# Altium project Pulser Driver 4,3(ProtoRev1).PrjPcb (part 1 of 2)
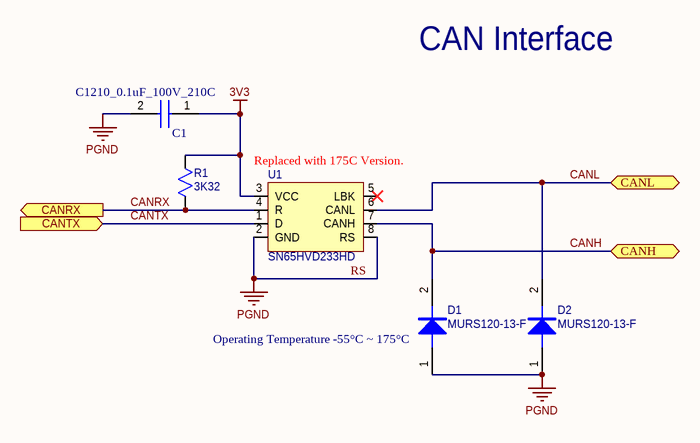
[diagram p0: Communications.SchDoc]
8 sheets, 224 parts. Net scope: flat (ports and power ports of the same name join across sheets).
Board file: Pulser Driver.PcbDoc
Sheets:
  Communications.SchDoc
  Control Interface.SchDoc
  230C_3V3_PSU_TPS40200.SchDoc
  Motor Driver.SchDoc
  230C_5V_PSU_TPS40200.SchDoc
  230C_12V_PSU_TPS40200.SchDoc
  Sensing.SchDoc
  Motor Interface.SchDoc

## Sheet Communications.SchDoc: Communications
size Tabloid; CompanyName: Vertex; Organization: Vertex Downhole Ltd.; Address1: 7004 5 St SE Unit C; Address2: Calgary, AB; Address3: T2H 2G3; Address4: Canada; DocumentNumber: 550014; Revision: 4.1; SheetNumber: 6; SheetTotal: 8; Operating Temperature Range: -55°C ~ 230°C

### Parts
C1  C1210_0.1uF_100V_210C  [C1210]
D1  MURS120-13-F  [SMB-D]
D2  MURS120-13-F  [SMB-D]
R1  3K32  [0603]
U1  SN65HVD233HD  [D8]

### Ports
CANH (bidir), CANL (bidir), CANRX (out), CANTX (in)

### Nets
3V3: C1.1 R1.2 U1.3(VCC)
RS: C1.2 D1.1(A) D2.1(A) U1.2(GND) U1.8(RS)  [also labelled PGND]
CANH: D1.2(K) U1.7(CANH) ; port CANH
CANL: D2.2(K) U1.6(CANL) ; port CANL
CANRX: R1.1 U1.4(R) ; port CANRX
CANTX: U1.1(D) ; port CANTX

Not connected (* = marked no-connect by the designer): U1 5(LBK)*

### Notes on the sheet
- CAN Interface
- (near U1) Replaced with 175C Version.
- (near D1) Operating Temperature -55°C ~ 175°C
- Title
- Size:
- Date:
- Tabloid
- Number:
- Time:
- Revision:
- Sheet
- of
- File:

### Library data of the parts
C1 = C1210H104J1GACTU: Capacitor; Manufacturer_Name: KEMET; Datasheet Link: https://content.kemet.com/datasheets/KEM_C1001_C0G_200C_SMD.pdf; Manufacturer_Part_Number: C1210H104J1GACTU; Mouser Part Number: 80-C1210H104J1GACTU; Mouser Price/Stock: https://www.mouser.co.uk/ProductDetail/KEMET/C1210H104J1GACTU?qs=w3%252Bcv6FlocpP4mccX4tnSA%3D%3D; Operating Temperature Range: -55C to +200C
D1 D2 = DIODE_1: Diode; Manufacturer: Diodes Inc.; Vendor: Digi-Key; Vendor PN: MURS120-FDITR-ND; Vertex PN: 6600001-01; Manu PN: MURS120-13-F
R1 = RES_3K32_0603_1%_1/10W: 3.32K OHM 1% 1/8W 0603; Manufacturer: Vishay; Vendor PN: 541-MCT0603MC3321FP500TR-ND; Vendor: Digi-Key; Manu PN: MCT0603MC3321FP500; Vertex PN: TBD; Supplier 1: Digikey; Supplier Part Number 1: 541-MCT0603MC3321FP500TR-ND
U1 = SN65HVD233HD: CAN Transceiver, 3V3; Manufacturer: TI; Vendor: DigiKey; Vendor PN: 296-28288-5-ND; Vertex PN: TBD; MPN: SN65HVD233HD; Footprint: SOIC-8; Operating Temperature Range: '-55C to 175C

## Sheet Control Interface.SchDoc: Control Interface
size Tabloid; CompanyName: Vertex; Organization: Vertex Downhole Ltd.; Address1: 10911 50th Street SE; Address2: Calgary, AB; Address3: T2C 3E5; Address4: Canada; DocumentNumber: 550014; Revision: 4.1; SheetNumber: 2; SheetTotal: 8
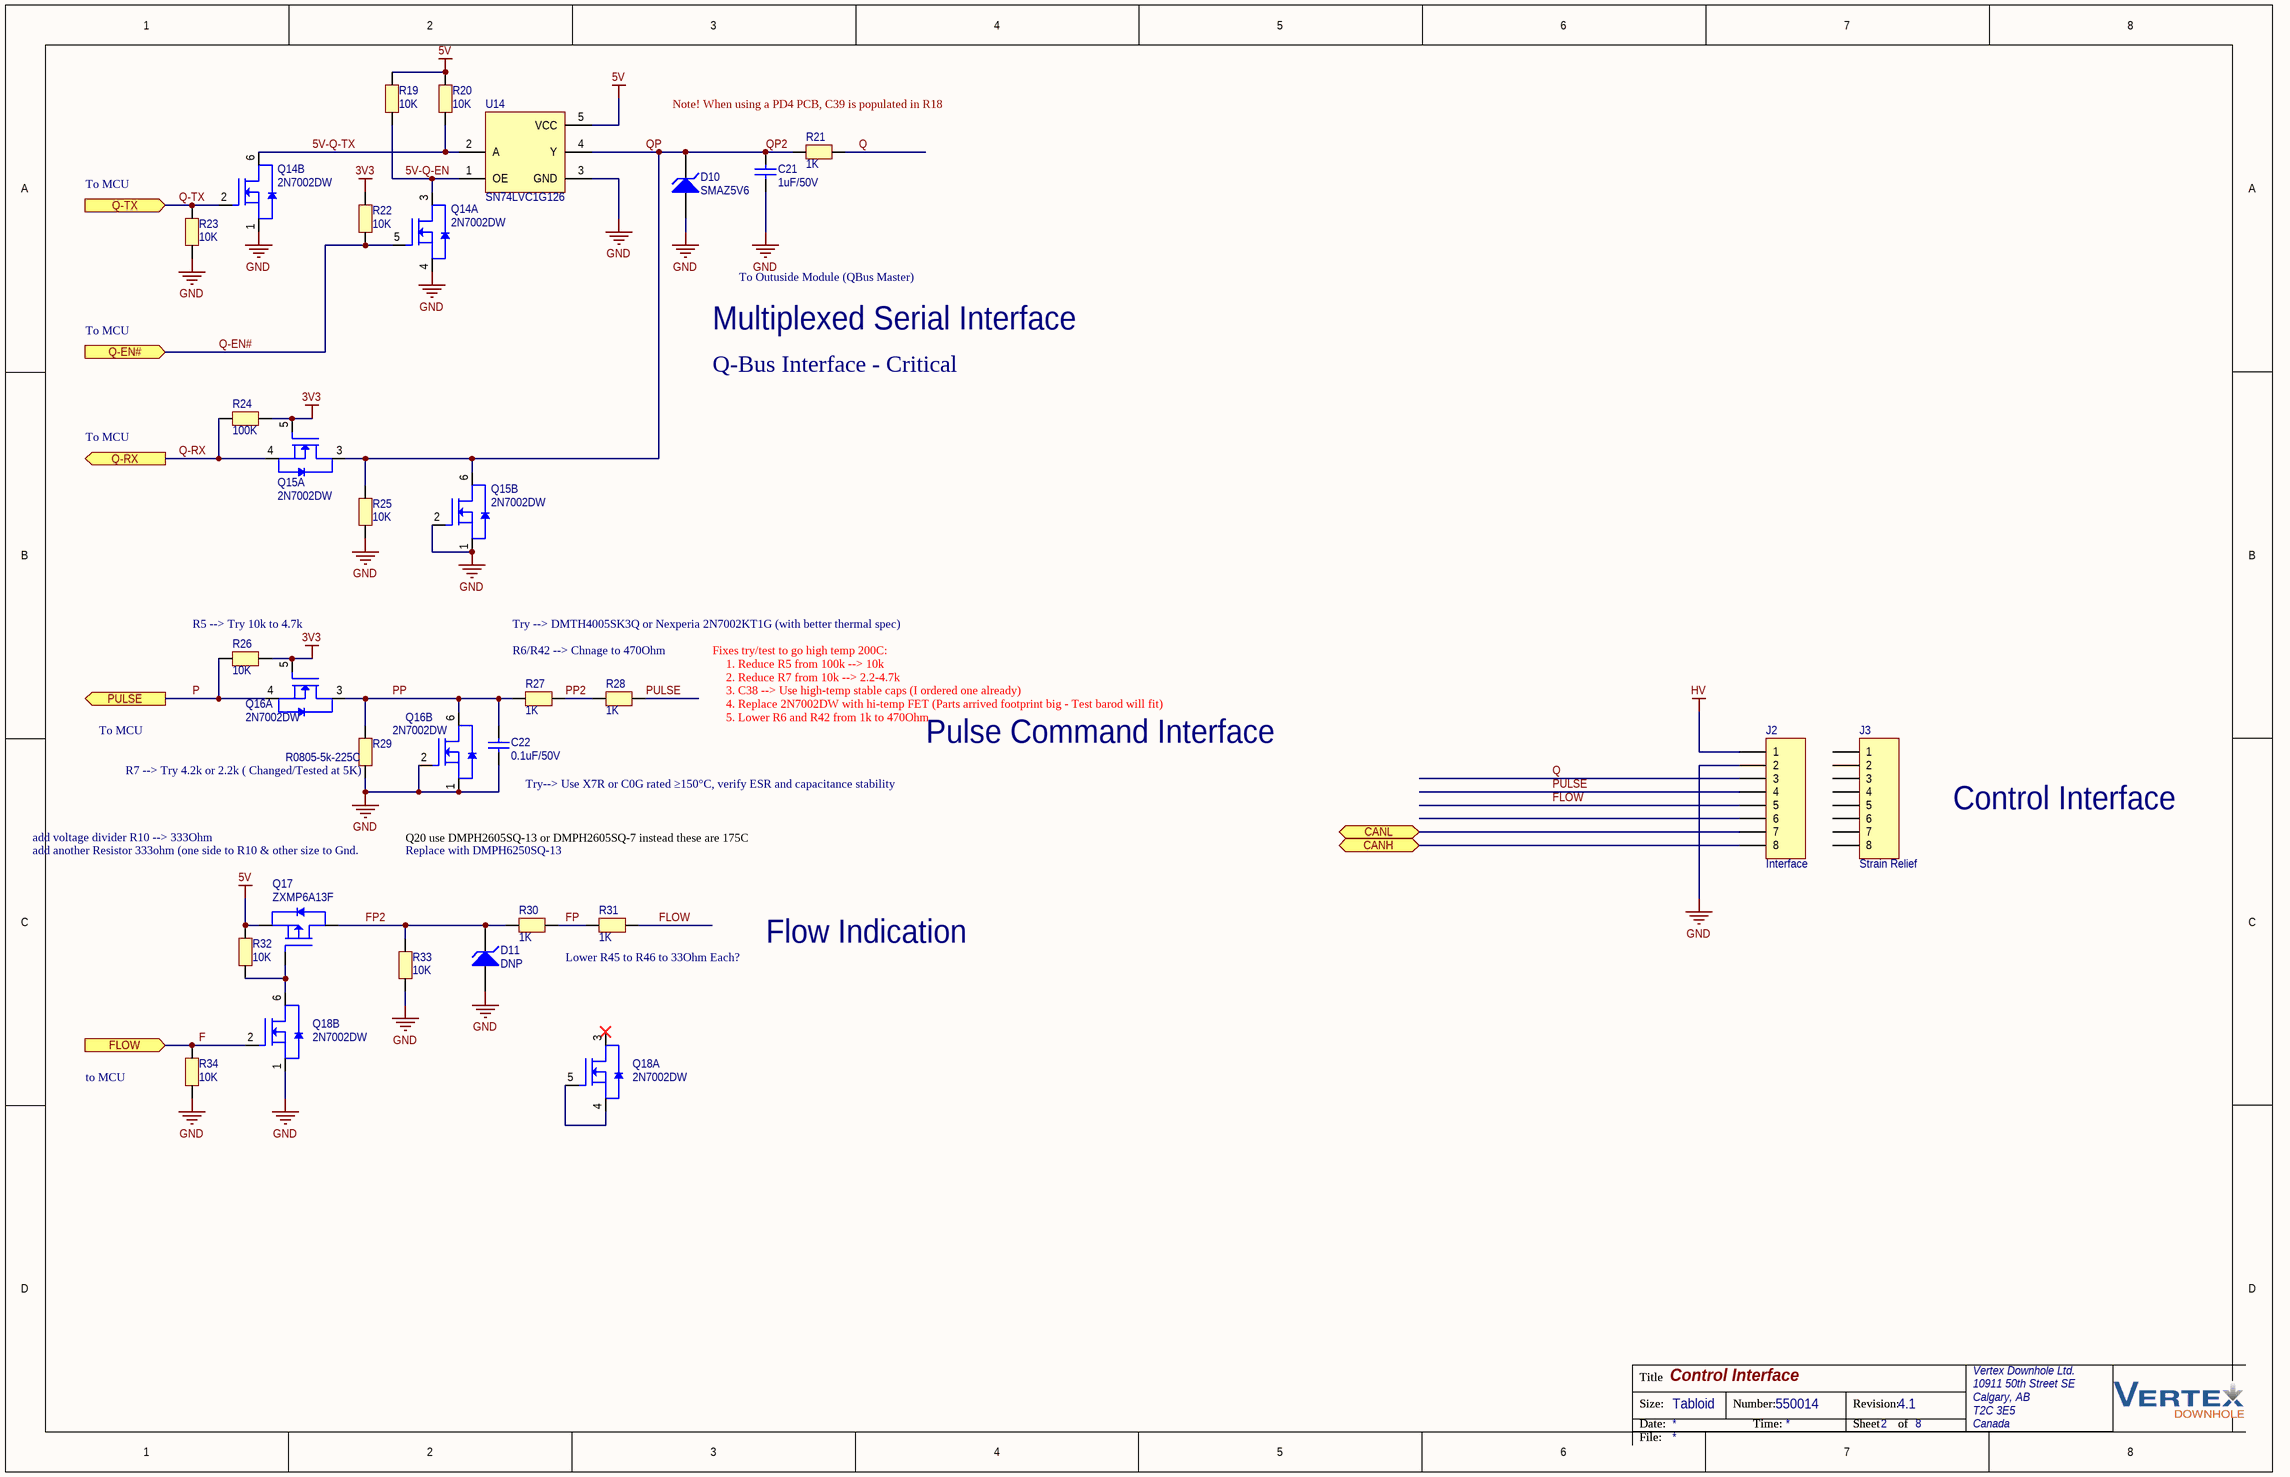
[diagram p1: Control Interface.SchDoc]

### Parts
C21  1uF/50V  [0805-CR]
C22  0.1uF/50V  [0805-CR]
D10  SMAZ5V6  [SMA]
D11  DNP  [SMA]
J2  Interface  [HDR1X8]
J3  Strain Relief  [HDR1X8]
Q14  2N7002DW  [DCK-6]  (parts A,B of 2)
Q15  2N7002DW  [DCK-6]  (parts A,B of 2)
Q16  2N7002DW  [DCK-6]  (parts A,B of 2)
Q17  ZXMP6A13F  [DGS]
Q18  2N7002DW  [DCK-6]  (parts A,B of 2)
R19  10K  [0805-CR]
R20  10K  [0805-CR]
R21  1K  [0805-CR]
R22  10K  [0805-CR]
R23  10K  [0805-CR]
R24  100K  [0805-CR]
R25  10K  [0805-CR]
R26  10K  [0805-CR]
R27  1K  [0805-CR]
R28  1K  [0805-CR]
R29  R0805-5k-225C  [0805]
R30  1K  [0805-CR]
R31  1K  [0805-CR]
R32  10K  [0805-CR]
R33  10K  [0805-CR]
R34  10K  [0805-CR]
U14  SN74LVC1G126  [DBV-5]

### Ports
CANH (bidir), CANL (bidir), FLOW (in), PULSE (out), Q-EN# (in), Q-RX (out), Q-TX (in)

### Nets
3V3: Q15.5(G1) Q16.5(G1) R22.1 R24.2 R26.1
5V: Q17.2(S) R19.1 R20.1 R32.1 U14.5(VCC)
GND: C21.1 C22.2 D10.1(A) D11.1(A) J2.2 Q14.1(S2) Q14.4(S1) Q15.1(S2) Q15.2(G2) Q16.1(S2) Q16.2(G2) Q18.1(S2) R23.2 R25.2 R29.2 R33.2 R34.2 U14.3(GND)
HV: J2.1  [project net 3V3_VDD]
5V-Q-EN: Q14.3(D1) R19.2 U14.1(OE)
5V-Q-TX: Q14.6(D2) R20.2 U14.2(A)
CANH: J2.8 ; port CANH
CANL: J2.7 ; port CANL
F: Q18.2(G2) R34.1 ; port FLOW
FLOW: J2.5 R31.2
FP: R30.2 R31.1
FP2: D11.2(K) Q17.3(D) R30.1 R33.1
P: Q16.4(S1) R26.2 ; port PULSE
PP: C22.1 Q16.3(D1) Q16.6(D2) R27.1 R29.1
PP2: R27.2 R28.1
PULSE: J2.4 R28.2
Q: J2.3 R21.2
Q-EN#: Q14.5(G1) R22.2 ; port Q-EN#
Q-RX: Q15.4(S1) R24.1 ; port Q-RX
Q-TX: Q14.2(G2) R23.1 ; port Q-TX
QP: C21.2 D10.2(K) Q15.3(D1) Q15.6(D2) R21.1 R25.1 U14.4(Y)  [also labelled QP2]
NetQ17_1: Q17.1(G) Q18.6(D2) R32.2
NetQ18_4: Q18.4(S1) Q18.5(G1)

Not connected (* = marked no-connect by the designer): J2 6; J3 1 2 3 4 5 6 7 8; Q18 3(D1)*

### Notes on the sheet
- Note! When using a PD4 PCB, C39 is populated in R18
- To MCU
- To Outuside Module (QBus Master)
- Multiplexed Serial Interface
- Q-Bus Interface - Critical
- R5 --> Try 10k to 4.7k
- Try --> DMTH4005SK3Q or Nexperia 2N7002KT1G (with better thermal spec)
- R6/R42 --> Chnage to 470Ohm
- Fixes try/test to go high temp 200C:
- 1. Reduce R5 from 100k --> 10k
- 2. Reduce R7 from 10k --> 2.2-4.7k
- 3. C38 --> Use high-temp stable caps (I ordered one already)
- 4. Replace 2N7002DW with hi-temp FET (Parts arrived footprint big - Test barod will fit)
- 5. Lower R6 and R42 from 1k to 470Ohm
- Pulse Command Interface
- (near R29) R7 --> Try 4.2k or 2.2k ( Changed/Tested at 5K)
- (near C22) Try--> Use X7R or C0G rated ≥150°C, verify ESR and capacitance stability
- Control Interface
- add voltage divider R10 --> 333Ohm
- add another Resistor 333ohm (one side to R10 & other size to Gnd.
- Replace with DMPH6250SQ-13
- Q20 use DMPH2605SQ-13 or DMPH2605SQ-7 instead these are 175C
- Lower R45 to R46 to 33Ohm Each?
- Flow Indication
- to MCU
- Title
- Size:
- Date:
- Tabloid
- Number:
- Time:
- Revision:
- Sheet
- of
- File:

### Library data of the parts
C21 = Cap: Capacitor; Manufacturer: TDK; Vendor: Digi-Key; Vendor PN: 445-CGA4J1X8L1H105K125ACCT-ND; Manu PN: CGA4J1X8L1H105K125AC; Vertex PN: TBD
C22 = Cap: Capacitor; Manufacturer: Murata Electronics North America; Vendor: Digi-Key; Vendor PN: 490-1666-1-ND; Manu PN: GRM21BR71H104KA01L; Vertex PN: 6280000
D10 D11 = D Zener: SMAZ5V6 5.6V Zener Diode; Manufacturer: Diodes Inc; Vendor: Digi-Key; Vendor PN: SMAZ5V6-FDICT-ND; Manu PN: SMAZ5V6-13-F; Vertex PN: 6600005
J2 J3 = Header 8: Header, 8-Pin
Q14-Q16 Q18 = 2N7002DW: 2N7002DW Dual N-Channel FET SC-70-6; Manufacturer: Fairchild Semiconductor; Vendor PN: 2N7002DWCT-ND; Vendor: Digi-Key; Vertex PN: 6500000; Manu PN: 2N7002DW
Q17 = Si2323DS: ZXMP6A13F 60V P-channel FET; Manufacturer: Diodes/Zetex; Manu PN: ZXMP6A13FTA; Vendor: Digi-Key; Vendor PN: ZXMP6A13FCT-ND; Vertex PN: 6500003
R19 R20 R22 R23 R25 R26 R32-R34 = RES: Resistor; Manufacturer: Yageo; Vendor PN: 311-10.0KCRCT-ND; Vendor: Digi-Key; Manu PN: RC0805FR-0710KL; Vertex PN: 6181002
R21 R27 R28 R30 R31 = RES: Resistor; Manufacturer: Yageo; Vendor PN: 311-1.00KCRCT-ND; Vendor: Digi-Key; Manu PN: RC0805FR-071KL; Vertex PN: 6180102
R24 = RES: Resistor; Manufacturer: Yageo; Vendor PN: 311-100KCRCT-ND; Vendor: Digi-Key; Manu PN: RC0805FR-07100KL; Vertex PN: 6181003
R29 = RES: Resistor; Manufacturer: VPG Foil Resistors; Vendor PN: Y4062-5.0KACT-ND; Vendor: Digi-Key; Manu PN: Y40625K00000Q0R
U14 = SN74LVC1G126: SN74LVC1G126DBV Tri-state Buffer (Non-Inverting OE); Manufacturer: Texas Instruments; Vendor: Digi-Key; Vendor PN: 296-11605-1-ND; Manu PN: SN74LVC1G126DBVR; Vertex PN: 6400024

## Sheet 230C_3V3_PSU_TPS40200.SchDoc: Communications
size Tabloid; CompanyName: Vertex; Organization: Vertex Downhole Ltd.; Address1: 7004 5 St SE Unit C; Address2: Calgary, AB; Address3: T2H 2G3; Address4: Canada; DocumentNumber: 550014; Revision: 4.1; SheetNumber: 6; SheetTotal: 8; Operating Temperature Range: -55°C ~ 230°C
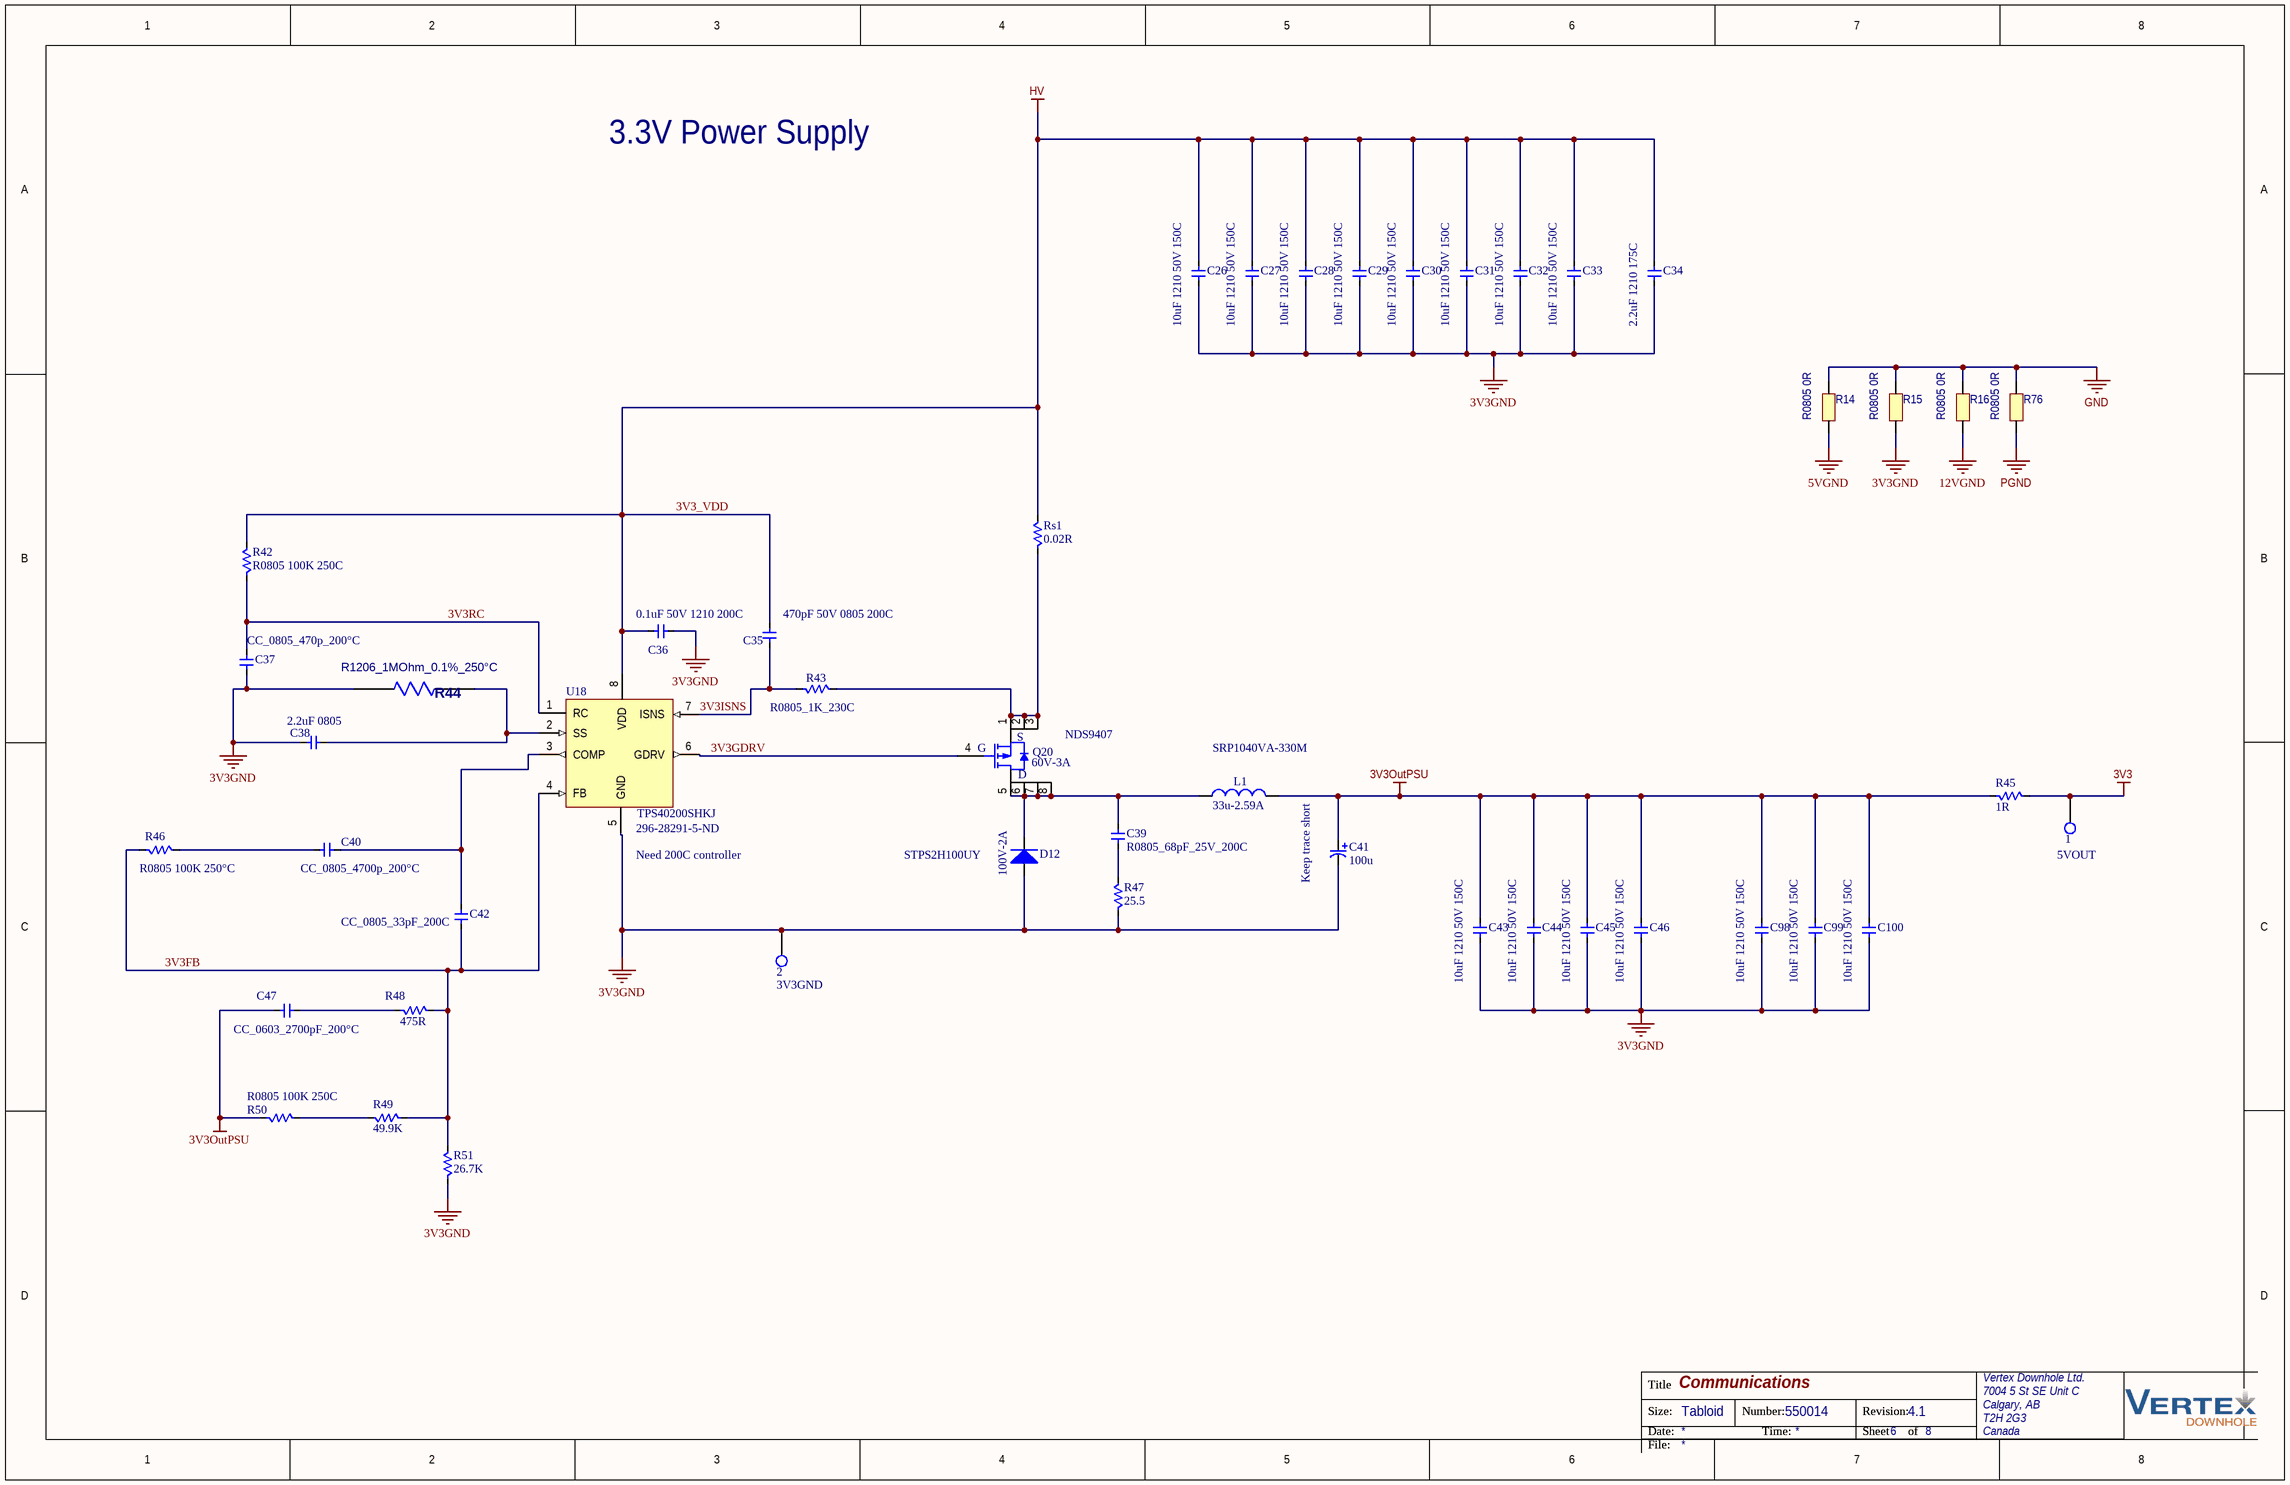
[diagram p2: 230C_3V3_PSU_TPS40200.SchDoc]

### Parts
1  5VOUT  [TP-S]  (no BOM)
2  3V3GND  [TP-S]  (no BOM)
C26  value 10uF 1210 50V 150C  [1210]  (hidden comment: GCM32EL8EH106KA07K)
C27  value 10uF 1210 50V 150C  [1210]  (hidden comment: GCM32EL8EH106KA07K)
C28  value 10uF 1210 50V 150C  [1210]  (hidden comment: GCM32EL8EH106KA07K)
C29  value 10uF 1210 50V 150C  [1210]  (hidden comment: GCM32EL8EH106KA07K)
C30  value 10uF 1210 50V 150C  [1210]  (hidden comment: GCM32EL8EH106KA07K)
C31  value 10uF 1210 50V 150C  [1210]  (hidden comment: GCM32EL8EH106KA07K)
C32  value 10uF 1210 50V 150C  [1210]  (hidden comment: GCM32EL8EH106KA07K)
C33  value 10uF 1210 50V 150C  [1210]  (hidden comment: GCM32EL8EH106KA07K)
C34  value 2.2uF 1210 175C  [1210]  (hidden comment: C1206H104J3GACTU)
C35  value 470pF 50V 0805 200C  [1210]  (hidden comment: C1206H104J3GACTU)
C36  value 0.1uF 50V 1210 200C  [0805]  (hidden comment: 0805D121J251KHT)
C37  value CC_0805_470p_200°C  [0805]  (hidden comment: C0805H471J1GACTU)
C38  value 2.2uF 0805  [0805]  (hidden comment: C0805C272K5HACTU)
C39  value R0805_68pF_25V_200C  [0805]  (hidden comment: C0805H680J3GACTU)
C40  value CC_0805_4700p_200°C  [0805]  (hidden comment: C0805H472J1GACT500)
C41  value 100u  [0805]  (hidden comment: 0805D121J251KHT)
C42  value CC_0805_33pF_200C  [1210]  (hidden comment: C1206H104J3GACTU)
C43  value 10uF 1210 50V 150C  [1210]  (hidden comment: GCM32EL8EH106KA07K)
C44  value 10uF 1210 50V 150C  [1210]  (hidden comment: GCM32EL8EH106KA07K)
C45  value 10uF 1210 50V 150C  [1210]  (hidden comment: GCM32EL8EH106KA07K)
C46  value 10uF 1210 50V 150C  [1210]  (hidden comment: GCM32EL8EH106KA07K)
C47  value CC_0603_2700pF_200°C  [0603]  (hidden comment: C1206H104J3GACTU)
C98  value 10uF 1210 50V 150C  [1210]  (hidden comment: GCM32EL8EH106KA07K)
C99  value 10uF 1210 50V 150C  [1210]  (hidden comment: GCM32EL8EH106KA07K)
C100  value 10uF 1210 50V 150C  [1210]  (hidden comment: GCM32EL8EH106KA07K)
D12  value 100V-2A  [SMB]  (hidden comment: STPS2H100UY)
L1  value 33u-2.59A  [IND_CB_DRA125]  (hidden comment: DRA125-470-R)
Q20  value 60V-3A  [SOIC_S9407_ONS]  (hidden comment: NDS9407)
R14  R0805 0R  [0805-CR]
R15  R0805 0R  [0805-CR]
R16  R0805 0R  [0805-CR]
R42  value R0805 100K 250C  [0805]  (hidden comment: PATT0805E1003BGT1)
R43  value R0805_1K_230C  [0805]  (hidden comment: ERJ-PB6B6812V)
R44  R1206_1MOhm_0.1%_250°C  [1206]
R45  value 1R  [0805]  (hidden comment: RS73F2ATTD1501B)
R46  value R0805 100K 250°C  [0805]  (hidden comment: PATT0805E1003BGT1)
R47  value 25.5  [0805]  (hidden comment: ERJ-PB6B1004V)
R48  value 475R  [0805]  (hidden comment: ERJ-PB6B6812V)
R49  value 49.9K  [0805]  (hidden comment: PATT0603E49R9BGT1)
R50  value R0805 100K 250C  [0805]  (hidden comment: PATT0805E1003BGT1)
R51  value 26.7K  [0805]  (hidden comment: RNCP0805FTD1R00)
R76  R0805 0R  [0805-CR]
Rs1  value 0.02R  [1206]  (hidden comment: ERJ-8CWFR020V)
U18  Supplier Part Number 1: 296-28291-5-ND  [SOIC_S9407_ONS]  (hidden comment: TPS40200SHKJ)

### Nets
3V3: 1.1 R45.2
3V3_VDD: C26.2 C27.2 C28.2 C29.2 C30.2 C31.2 C32.2 C33.2 C34.2 C35.1 C36.1 R42.2 Rs1.2 U18.8(VDD)  [also labelled HV]
3V3GND: 2.1 C26.1 C27.1 C28.1 C29.1 C30.1 C31.1 C32.1 C33.1 C34.1 C36.2 C37.1 C38.1 C41.2 C43.1 C44.1 C45.1 C46.1 C98.1 C99.1 C100.1 D12.A R15.1 R44.1(A) R47.1 R51.1 U18.5(GND)
3V3OutPSU: C41.1 C43.2 C44.2 C45.2 C46.2 C47.1 C98.2 C99.2 C100.2 L1.2 R45.1 R50.1
5VGND: R14.1
12VGND: R16.1
GND: R14.2 R15.2 R16.2 R76.2
PGND: R76.1  [project net RS]
3V3FB: C42.1 R46.1 R48.2 R49.1 R51.2 U18.4(FB)
3V3GDRV: Q20.4(G) U18.6(GDRV)
3V3ISNS: C35.2 R43.1 U18.7(ISNS)
3V3RC: C37.2 R42.1 U18.1(RC)
NetC38_2: C38.2 R44.2(B) U18.2(SS)
NetC39_1: C39.1 R47.2
NetC39_2: C39.2 D12.K L1.1 Q20.5(D) Q20.6(D) Q20.7(D) Q20.8(D)
NetC40_1: C40.1 R46.2
NetC40_2: C40.2 C42.2 U18.3(COMP)
NetC47_2: C47.2 R48.1
NetQ20_1: Q20.1(S) Q20.2(S) Q20.3(S) R43.2 Rs1.1
NetR49_2: R49.2 R50.2

### Notes on the sheet
- 3.3V Power Supply
- (near Q20) NDS9407
- (near L1) SRP1040VA-330M
- (near U18) Need 200C controller
- STPS2H100UY
- Keep trace short
- Title
- Size:
- Date:
- Tabloid
- Number:
- Time:
- Revision:
- Sheet
- of
- File:

### Library data of the parts
1 2 = TP: Test  Point; Number: PMT104887; Subtype: Test Loop; Num Connections: 1; RoHS: 0; Package: Through hole
C26 C43 = CC-1210: CAP CER 0.1UF 50V C0G/NP0 1210 200C; Tolerance: ±10%; Temp. Coeff.: X8L; Mfg: Murata Electronics; Vendor: Digi-Key; VendorPN: 490-GCM32EL8EH106KA07KCT-ND; Do not load: 0; Class: Epart; CES#: *; Voltage: 50V; Temperature: -55°C ~ 150°C; Height: 1.6mm; MfgPN: GCM32EL8EH106KA07K; Unit Price: 19.5; Notes: *; Package: CC-1210; Dimension: 3.20mm x 1.60mm; #1Mfg: *; #1MfgPN: *; Temperature Tested: *
C27-C33 C44-C46 C98-C100 = CC-1210: CAP CER 0.1UF 50V C0G/NP0 1210 200C; Tolerance: ±5%; Temp. Coeff.: X8L; Mfg: Murata Electronics; Vendor: Digi-Key; VendorPN: 490-GCM32EL8EH106KA07KCT-ND; Do not load: 0; Class: Epart; CES#: *; Voltage: 50V; Temperature: -55°C ~ 200°C; Height: 1.6mm; MfgPN: GCM32EL8EH106KA07K; Unit Price: 19.5; Notes: *; Package: CC-1210; Dimension: 3.20mm x 1.60mm; #1Mfg: *; #1MfgPN: *; Temperature Tested: *
C34 = CC-1210: CAP CER 0.1UF 50V C0G/NP0 1210 200C; Voltage: 25V; Tolerance: ±5%; Temp. Coeff.: C0G, NP0; Mfg: KEMET; Vendor: Digi-Key; VendorPN: 399-5750; Do not load: 0; Class: Epart; CES#: *; Temperature: -55°C ~ 200°C; Height: 1.6mm; MfgPN: C1206H104J3GACTU; Unit Price: 19.5; Notes: *; Package: CC-1206; Dimension: 3.20mm x 1.60mm; #1Mfg: *; #1MfgPN: *; Temperature Tested: *
C35 = CC-0805-100p-100V-10%-200C-NP0: CAP CER 470PF 50V C0G/NP0 0805 200C; Voltage: 100V; Tolerance: ±5%; Temp. Coeff.: C0G, NP0; Mfg: Vishay Vitramont; MfgPN: VJ0805D471JXAQJHT; Vendor: Digi-Key; VendorPN: 720-VJ0805D471JXAQJHTCT-ND; Do not load: 0; Class: Epart; Temperature: -55°C ~ 200°C; Height: 1.37mm; Unit Price: 0.34; Notes: *; Package: CC-0805; Dimension: 1.60mm x 0.80mm; #1Mfg: *; #1MfgPN: *; Temperature Tested: *
C36 = CC-1210: CAP CER 0.1UF 50V C0G/NP0 1210 200C; Voltage: 25V; Tolerance: ±5%; Temp. Coeff.: C0G, NP0; Mfg: KEMET; MfgPN: C1206H104J3GACTU; Vendor: Digi-Key; VendorPN: 399-5750; Do not load: 0; Class: Epart; CES#: *; Temperature: -55°C ~ 200°C; Height: 1.6mm; Unit Price: 19.5; Notes: *; Package: CC-1206; Dimension: 3.20mm x 1.60mm; #1Mfg: *; #1MfgPN: *; Temperature Tested: *
C37 = CC-0805-470p-100V-10%-150C-NP0: CAPACITOR CER 470PF 100V C0G/NP0 0805; Tolerance: ±10%; Temp. Coeff.: C0G, NP0; Mfg: KEMET; Vendor: Digi-Key; VendorPN: 720-1262; Do not load: 0; Class: Epart; CES#: *; Voltage: 100V; Temperature: -55°C ~ 200°C; Height: 1.25mm; MfgPN: C0805H471J1GACTU; Unit Price: 0.47; Notes: *; Package: CC-0805; Dimension: 2.00mm x 1.25mm; #1Mfg: *; #1MfgPN: *; Temperature Tested: *
C38 = CC-0805-47n-25V-5%-125C-NP0: CAPACITOR CER 0.047UF 25V C0G/NP0 0805; Tolerance: ±5%; Temp. Coeff.: C0G, NP0; Mfg: KEMET; MfgPN: C0805C473J3GACAUTO; Vendor: Digi-Key; VendorPN: 399-6970; Do not load: 0; Class: Epart; CES#: *; Voltage: 25V; Temperature: -55°C ~ 125°C; Height: 1.25mm; Unit Price: 0.95; Notes: *; Package: CC-0805; Dimension: 2.00mm x 1.25mm; #1Mfg: *; #1MfgPN: *; Temperature Tested: *
C39 = CC-0805-2200p-100V-5%-200C-NP0: CAPACITOR CER 2200PF 100V C0G/NP0 0805; Tolerance: ±5%; Temp. Coeff.: C0G, NP0; Mfg: KEMET; Vendor: Mouser; VendorPN: 80-C0805H680J3G; Do not load: 0; Class: Epart; Voltage: 100V; Temperature: -55°C ~ 200°C; Height: 0.9mm; MfgPN: C0805H680J3GACTU; Unit Price: 2.65; Notes: *; Package: CC-0805; Dimension: 2.00mm x 1.25mm; #1Mfg: *; #1MfgPN: *; Temperature Tested: *; Supplier 1: Digi-Key
C40 = CC-0805-2200p-100V-5%-200C-NP0: CAPACITOR CER 2200PF 100V C0G/NP0 0805; Tolerance: ±5%; Temp. Coeff.: C0G, NP0; Mfg: KEMET; Vendor: Digi-Key; VendorPN: 399-9996-2-ND; Do not load: 0; Class: Epart; Voltage: 100V; Temperature: -55°C ~ 200°C; Height: 0.9mm; MfgPN: C0805H472J1GACT500; Unit Price: 2.65; Notes: *; Package: CC-0805; Dimension: 2.00mm x 1.25mm; #1Mfg: *; #1MfgPN: *; Temperature Tested: *; Supplier 1: Digi-Key
C41 = CT-2917-100u-16V-10%-150C: CAPACITOR TANT 100UF 16V 10% 2917; Mfg: KEMET; MfgPN: T498X107K016ATE075; Vendor: Digi-Key; VendorPN: 399-5207; Do not load: 0; Class: Epart; CES#: *; Voltage: 16V; Tolerance: ±10%; Temperature: -55°C ~ 150°C; Height: 4.1mm; Unit Price: 6.63; Notes: *; Package: CT-2917; Dimension: 7.30mm x 4.30mm; #1Mfg: *; #1MfgPN: *; Temperature Tested: *
C42 = CC-0805-120p-100V-5%-200C-NP0: CAPACITOR CER 120PF 250V NP0 0805; Tolerance: ±5%; Temp. Coeff.: C0G, NP0; Mfg: Knowles Novacap; MfgPN: 0805D121J251KHT; Vendor: Digi-Key; Do not load: 0; Class: Epart; Voltage: 250V; Temperature: -55°C ~ 200°C; Height: 1.37mm; VendorPN: 0805D121J251KHT; Unit Price: 0.25; Notes: *; Package: CC-0805; Dimension: 2.03mm x 1.27mm; #1Mfg: *; #1MfgPN: *; Temperature Tested: *
C47 = CC-0805-2700p-50V-10%-150C: CAPACITOR CER 2700PF 50V X8R 0805; Tolerance: ±5%; Temp. Coeff.: C0G; Mfg: KEMET; MfgPN: C0603H272J5GACTU; Vendor: Digi-Key; VendorPN: 399-C0603H272J5GACTUCT-ND; Do not load: 0; Class: Epart; CES#: *; Voltage: 50V; Temperature: -55°C ~ 200°C; Height: 1.25mm; Unit Price: 0.84; Notes: *; Package: CC-0805; Dimension: 2.00mm x 1.25mm; #1Mfg: *; #1MfgPN: *; Temperature Tested: *
D12 = DS-SMB-100V-2A: DIODE SCHOTTKY 100V 2A SMB; Mfg: STMicroelectronics; Vendor: Digi-Key; VendorPN: 497-11093; Do not load: 0; Class: Epart; CES#: *; Temperature: -40°C ~ 175°C; Voltage: 100V; Height: 1.9 mm; MfgPN: STPS2H100UY; Unit Price: 0.81; Notes: *; Current: 2A; Package: SMB; Dimension: 3.5 X 2.8 X 1.9 mm; #1Mfg: *; #1MfgPN: *; Temperature Tested: *
L1 = LL-12.5X12.5-47u-2.59A: INDUCTOR 47UH 2.59A 81 MOHM; DC Resistance (DCR): 81 mOhm; Mfg: Eaton; Vendor: Digi-Key; VendorPN: 283-3577; Do not Load: 0; Tolerance: ±20%; Class: Epart; CES#: *; Temperature: -40°C ~ 165°C; Height: 6 mm; MfgPN: DRA125-470-R; Unit Price: 4.36; Current: 2.59A; Package: LL-12.5X12.5; Dimension: 12.50mm x 12.50mm; #2Mfg: *; #2MfgPN: *; Temperature Tested: *
Q20 = QF-SOIC8-PCH-60V-3A: MOSFET P-CH 60V 3A 8-SOIC; Mfg: ON Semiconductor; Vendor: Digi-Key; Do not Load: 0; Power: 2.5W (Ta); Rds On: 150 mOhm @ 3A, 10V; Class: Epart; Temperature: -55°C ~ 175°C (TJ); Voltage: 60V; Height: 1.7 mm; MfgPN: NDS9407; VendorPN: NDS9407; Unit price: 1.55; Package: SOIC8; Dimension: 6.2 X 5.0 X 1.7 mm; Current: 3A; #2Mfg: *; #2MfgPN: *; Temperature Tested: *
R14-R16 R76 = RES: as R19 on sheet Control Interface
R42 R46 R50 = RS-0805-9.1K-0.1%-1/4W-155C: 100 kOhms ±0.1% 0.2W, 1/5W Chip Resistor 0805 (2012 Metric); Temp. Coeff.: ±25ppm/°C; Mfg: Vishay Dale Thin Film; Vendor: Digi-Key; VendorPN: 764-1065-1-ND; Do not load: 0; Power: 0.25W; Class: Epart; Tolerance: ±0.1%; Temperature: -55°C ~ 250°C; Height: 0.46 mm; MfgPN: PATT0805E1003BGT1; Unit Price: 0.55; Notes: *; Package: RS-0805; Dimension: 1.60mm x 0.80mm; #2Mfg: *; #2MfgPN: *; Temperature Tested: *
R43 = RS-0805-1K-0.1%-1/8W-155C: RESISTOR SMD 1K OHM 0.1% 1/8W 0805; Tolerance: ±1%; Temp. Coeff.: ±25ppm/°C; Mfg: Vishay / Sfernice; MfgPN: CHPHT0805K1001FGT; Vendor: Mouser; VendorPN: 71-CHPHT0805K1001FGT; Do not load: 0; Power: 0.125W; Class: Epart; CES#: *; Temperature: -55°C ~ 230°C; Height: 0.7 mm; Notes: *; Package: RS-0805; Dimension: 2.00mm x 1.25mm; #2Mfg: *; #2MfgPN: *; Temperature Tested: *
R44 = RC_1206: 1206; Part Field 1: Description Resistor in 1206 package; MPN: PATT1206E1004BGT1; Mfr: Vishay Dale Thin Film
R45 = RS-0805-1R-1%-0.25W-155C: RESISTOR SMD 1 OHM 1% 1/4W 0805; Temp. Coeff.: ±100ppm/°C; Mfg: Stackpole Electronics Inc.; MfgPN: RNCP0805FTD1R00; Vendor: Digi-Key; Do not load: 0; Power: 0.25W; Class: Epart; CES#: *; Tolerance: ±1%; Temperature: -55°C ~ 155°C; Height: 0.7 mm; VendorPN: RNCP0805FTD1R00; Unit Price: 0.15; Notes: *; Package: RS-0805; Dimension: 2.00mm x 1.25mm; #2Mfg: *; #2MfgPN: *; Temperature Tested: *
R47 = RS-0805-10.2K-0.1%-0.25W-155C: RESISTOR SMD 10.2K OHM 1% 1/4W 0805; Temp. Coeff.: ±50ppm/°C; Mfg: Panasonic Electronic Components; MfgPN: ERJ-PB6B1022V; Vendor: Digi-Key; VendorPN: P20709TR-ND; Do not load: 0; Power: 0.25W; Class: Epart; Tolerance: ±1%; Temperature: -55°C ~ 155°C; Height: 0.7 mm; Unit Price: 0.55; Notes: *; Package: RS-0805; Dimension: 2.00mm x 1.25mm; #2Mfg: *; #2MfgPN: *; Temperature Tested: *
R48 = RS-0805-475R-0.1%-0.25W-155C: RESISTOR SMD 475 OHM 0.1% 1/10W 0805; Temp. Coeff.: ±50ppm/°C; Mfg: Panasonic Electronic Components; MfgPN: ERJ-PB6B4750V; Vendor: Digi-Key; VendorPN: P20557; Do not load: 0; Power: 0.25W; Class: Epart; Tolerance: ±0.1%; Temperature: -55°C ~ 155°C; Height: 0.7 mm; Unit Price: 0.55; Notes: *; Package: RS-0805; Dimension: 2.00mm x 1.25mm; #2Mfg: *; #2MfgPN: *; Temperature Tested: *
R49 = RS-0805-1.5K-0.1%-1/4W-155C: 49.9 Ohms ±0.1% 0.15W Chip Resistor 0603 (1608 Metric) Anti-Sulfur, Automotive AEC-Q200, Moisture Resistant Thin Film; Temp. Coeff.: ±25ppm/°C; Mfg: Vishay Dale Thin Film; Vendor: Digi-Key; VendorPN: 764-1019-1-ND; Do not load: 0; Power: 0.250W; Class: Epart; CES#: *; Tolerance: ±0.1%; Temperature: -55°C ~ 255°C; Height: 0.46 mm; MfgPN: PATT0603E49R9BGT1; Notes: *; Package: RS-0805; Dimension: 2.00mm x 1.25mm; #2Mfg: *; #2MfgPN: *; Temperature Tested: *
R51 = RS-0805-49.9R-0.25%-0.25W-155C: RESISTOR SMD 49.9 OHM 0.1% 1/25W 0805; Temp. Coeff.: ±25ppm/°C; Mfg: KOA Speer Electronics, Inc.; MfgPN: RS73G2ATTD49R9C; Vendor: Digi-Key; VendorPN: 2019-RS73G2ATTD49R9CTR-ND; Do not load: 0; Power: 0.25W; Class: Epart; Tolerance: ±0.1%; Temperature: -55°C ~ 155°C; Height: 0.5 mm; Unit Price: 0.113; Notes: *; Package: RS-0603; Dimension: 1.60mm x 0.80mm; #2Mfg: *; #2MfgPN: *; Temperature Tested: *
Rs1 = RS-1206-0.02R-1%-1W-155C: RESISTOR SMD 0.02 OHM 1% 1W 1206; Temp. Coeff.: ±75ppm/°C; Mfg: Panasonic Electronic Components; Vendor: Digi-Key; VendorPN: P0.02BV; Do not load: 0; Class: Epart; CES#: *; Tolerance: ±1%; Temperature: -55°C ~ 155°C; Height: 0.6; MfgPN: ERJ-8CWFR020V; Unit Price: 1.04; Notes: *; Power: 1W; Package: RS-1206; Dimension: 1.60mm x 3.20mm; #2Mfg: *; #2MfgPN: *; Temperature Tested: *
U18 = UP-SREG-CFP8-Buck-ADJ-TPS40200: IC REG CTRLR BUCK 8CFP; Mfg: Texas Instruments; Vendor: Digi-Key; VendorPN: 296-28291; Do not load: 0; Voltage Output: Adjustive; Voltage Input: 5.5 V ~ 52 V; Class: Epart; Topology: Buck; Temperature: -55°C ~ 210°C (TA); Height: 2.0 mm; MfgPN: TPS40200SHKJ; Unit Price: 140.54; Notes: *; Package: CFP-8; Dimension: 24.7 X 7.3 X 2.0; #2Mfg: *; #2MfgPN: *; Temperature Tested: *; Value: TPS40200SHKJ; Supplier 1: Digi-Key

## Sheet Motor Driver.SchDoc: Motor Driver
size Tabloid; CompanyName: Vertex; Organization: Vertex Downhole Ltd.; Address1: 10911 50th Street SE; Address2: Calgary, AB; Address3: T2C 3E5; Address4: Canada; DocumentNumber: 550014; Revision: 4.1; SheetNumber: 8; SheetTotal: 8
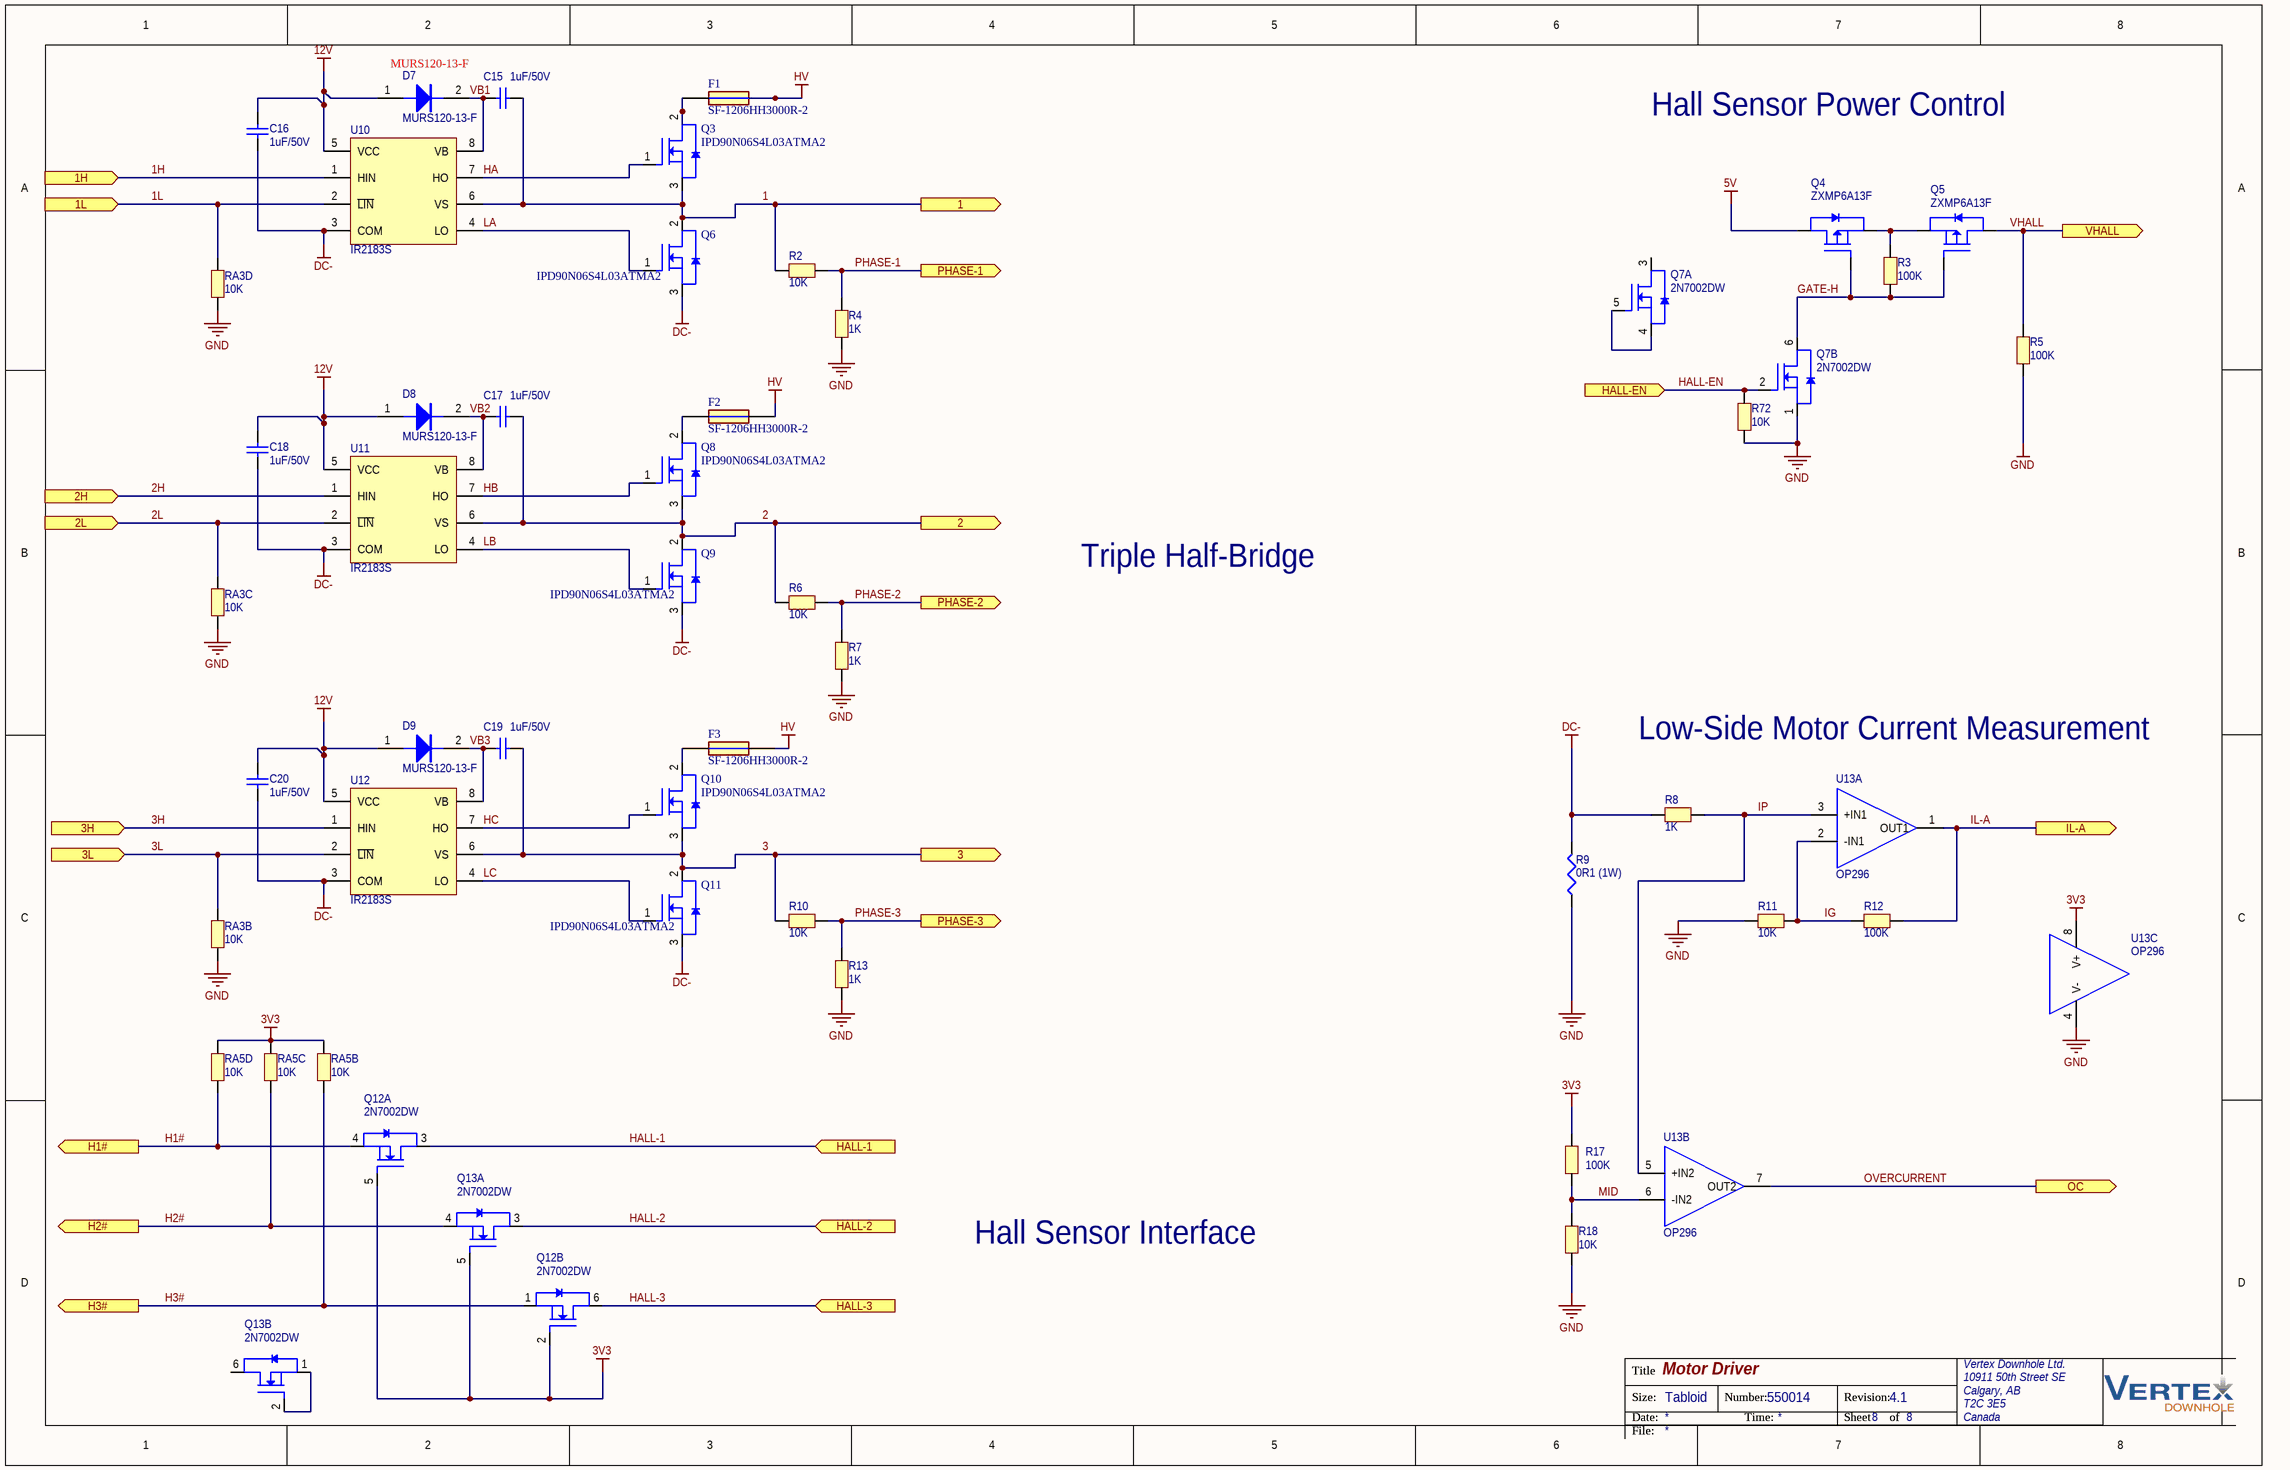
[diagram p3: Motor Driver.SchDoc]

### Parts
C15  1uF/50V  [1206-CR]
C16  1uF/50V  [1206-CR]
C17  1uF/50V  [1206-CR]
C18  1uF/50V  [1206-CR]
C19  1uF/50V  [1206-CR]
C20  1uF/50V  [1206-CR]
D7  MURS120-13-F  [SMB-D]
D8  MURS120-13-F  [SMB-D]
D9  MURS120-13-F  [SMB-D]
F1  SF-1206HH3000R-2  [SF1206HH3000R2]
F2  SF-1206HH3000R-2  [SF1206HH3000R2]
F3  SF-1206HH3000R-2  [SF1206HH3000R2]
Q3  IPD90N06S4L03ATMA2  [TO228P998X235-3N-2-V]
Q4  ZXMP6A13F  [DGS]
Q5  ZXMP6A13F  [SOT-23_DIO]
Q6  IPD90N06S4L03ATMA2  [TO228P998X235-3N-2-V]
Q7  2N7002DW  [DCK-6]  (parts A,B of 2)
Q8  IPD90N06S4L03ATMA2  [TO228P998X235-3N-2-V]
Q9  IPD90N06S4L03ATMA2  [TO228P998X235-3N-2-V]
Q10  IPD90N06S4L03ATMA2  [TO228P998X235-3N-2-V]
Q11  IPD90N06S4L03ATMA2  [TO228P998X235-3N-2-V]
Q12  2N7002DW  [DCK-6]  (parts A,B of 2)
Q13  2N7002DW  [DCK-6]  (parts A,B of 2)
R2  10K  [0805-CR]
R3  100K  [0805-CR]
R4  1K  [0805-CR]
R5  100K  [0805-CR]
R6  10K  [0805-CR]
R7  1K  [0805-CR]
R8  1K  [0805-CR]
R9  0R1 (1W)  [2512-CR]
R10  10K  [0805-CR]
R11  10K  [0805-CR]
R12  100K  [0805-CR]
R13  1K  [0805-CR]
R17  100K  [0805-CR]
R18  10K  [0805-CR]
R72  10K  [0805-CR]
RA3  10K  [742x083]  (parts B,C,D of 4)
RA5  10K  [742x083]  (parts B,C,D of 4)
U10  IR2183S  [D8]
U11  IR2183S  [D8]
U12  IR2183S  [D8]
U13  OP296  [D8]  (parts A,B,C of 3)

### Ports
1 (out), 1H (in), 1L (in), 2 (out), 2H (in), 2L (in), 3 (out), 3H (in), 3L (in), H1# (out), H2# (out), H3# (out), HALL-1 (in), HALL-2 (in), HALL-3 (in), HALL-EN (in), IL-A (out), OC (out), PHASE-1 (out), PHASE-2 (out), PHASE-3 (out), VHALL (out)

### Nets
3V3: Q12.2(G2) Q12.5(G1) Q13.5(G1) R17.2 RA5.3 RA5.5 RA5.7 U13.8(V+)
5V: Q4.3(D)
12V: C16.2 C18.2 C20.2 D7.1(A) D8.1(A) D9.1(A) U10.5(VCC) U11.5(VCC) U12.5(VCC)
DC-: C16.1 C18.1 C20.1 Q6.3(S) Q9.3(S) Q11.3(S) R8.1 R9.2 U10.3(COM) U11.3(COM) U12.3(COM)
GND: Q7.1(S2) R4.1 R5.2 R7.1 R9.1 R11.1 R13.1 R18.2 R72.2 RA3.4 RA3.6 RA3.8 U13.4(V-)
HV: F1.2 F2.2 F3.2  [project net 3V3_VDD]
1: C15.1 Q3.3(S) Q6.2(D) R2.1 U10.6(VS) ; port 1
1H: U10.1(HIN) ; port 1H
1L: RA3.7 U10.2(~{LIN}) ; port 1L
2: C17.1 Q8.3(S) Q9.2(D) R6.1 U11.6(VS) ; port 2
2H: U11.1(HIN) ; port 2H
2L: RA3.5 U11.2(~{LIN}) ; port 2L
3: C19.1 Q10.3(S) Q11.2(D) R10.1 U12.6(VS) ; port 3
3H: U12.1(HIN) ; port 3H
3L: RA3.3 U12.2(~{LIN}) ; port 3L
GATE-H: Q4.1(G) Q5.1(G) Q7.6(D2) R3.1
H1#: Q12.4(S1) RA5.8 ; port H1#
H2#: Q13.4(S1) RA5.6 ; port H2#
H3#: Q12.1(S2) RA5.4 ; port H3#
HA: Q3.1(G) U10.7(HO)
HALL-1: Q12.3(D1) ; port HALL-1
HALL-2: Q13.3(D1) ; port HALL-2
HALL-3: Q12.6(D2) ; port HALL-3
HALL-EN: Q7.2(G2) R72.1 ; port HALL-EN
HB: Q8.1(G) U11.7(HO)
HC: Q10.1(G) U12.7(HO)
IG: R11.2 R12.1 U13.2(-IN1)
IL-A: R12.2 U13.1(OUT1) ; port IL-A
IP: R8.2 U13.3(+IN1) U13.5(+IN2)
LA: Q6.1(G) U10.4(LO)
LB: Q9.1(G) U11.4(LO)
LC: Q11.1(G) U12.4(LO)
MID: R17.1 R18.1 U13.6(-IN2)
OVERCURRENT: U13.7(OUT2) ; port OC
PHASE-1: R2.2 R4.2 ; port PHASE-1
PHASE-2: R6.2 R7.2 ; port PHASE-2
PHASE-3: R10.2 R13.2 ; port PHASE-3
VB1: C15.2 D7.2(K) U10.8(VB)
VB2: C17.2 D8.2(K) U11.8(VB)
VB3: C19.2 D9.2(K) U12.8(VB)
VHALL: Q5.3(D) R5.1 ; port VHALL
NetF1_1: F1.1 Q3.2(D)
NetF2_1: F2.1 Q8.2(D)
NetF3_1: F3.1 Q10.2(D)
NetQ4_2: Q4.2(S) Q5.2(S) R3.2
NetQ7_4: Q7.4(S1) Q7.5(G1)
NetQ13_1: Q13.1(S2) Q13.2(G2)

Not connected (* = marked no-connect by the designer): Q7 3(D1); Q13 6(D2)

### Notes on the sheet
- MURS120-13-F
- Hall Sensor Power Control
- Triple Half-Bridge
- Low-Side Motor Current Measurement
- Hall Sensor Interface
- Title
- Size:
- Date:
- Tabloid
- Number:
- Time:
- Revision:
- Sheet
- of
- File:

### Library data of the parts
C15-C20 = Cap: Capacitor; Manufacturer: Murata Electronics North America; Vendor: Digi-Key; Vendor PN: 490-4795-1-ND; Manu PN: GCM31MR71H105KA55L; Vertex PN: 6221004
D7-D9 = DIODE_1: as D1 on sheet Communications; Manu PN: MURS120-13-F
F1-F3 = SF-1206HH3000R-2: 1206 high-current met-foil. 30A; Manufacturer_Name: Bourns; Geometry.Height: 1.2mm; Mouser Part Number: 652-SF-1206HH3000R-2; Mouser Price/Stock: https://www.mouser.co.uk/ProductDetail/Bourns/SF-1206HH3000R-2?qs=Imq1NPwxi749RSSbSyFccA%3D%3D; Manufacturer_Part_Number: SF-1206HH3000R-2; Datasheet Link: https://www.bourns.com/docs/Product-Datasheets/SF-1206HH-R.pdf
Q3 Q6 Q8-Q11 = IPD90N06S4L03ATMA2: MOSFET N-CH 60V 90A TO252-31; Manufaturer: Infineon; Vendor: Digi-Key; Vendor PN: 448-IPD90N06S4L03ATMA2CT-ND; Manu PN: IPD90N06S4L03ATMA2
Q4 Q5 = Si2323DS: as Q17 on sheet Control Interface
Q7 Q12 Q13 = 2N7002DW: as Q14 on sheet Control Interface; Manu PN: 2N7002DW
R2 R3 R6 R10 R11 R18 R72 = RES: as R19 on sheet Control Interface
R4 R7 R8 R13 = RES: as R21 on sheet Control Interface
R5 R12 R17 = RES: as R24 on sheet Control Interface
R9 = RES1: RES 0.1 OHM 1% 1W 2512; Manufacturer: Vishay/Dale; Vendor: Digi-Key; Vendor PN: WSLG-.10CT-ND; Manu PN: WSL2512R1000FEA; Vertex PN: 6150001
RA3 RA5 = 742x083: 742 4-Isolated 50V (0603x4) Resistor Array; Manufacturer: CTS Resistor Products; Vendor PN: 742C083103JPCT-ND; Vendor: Digi-Key; Manu PN: 742C083103JP; Vertex PN: 6108103
U10-U12 = IR2183S: IR2183S Dual High/Low Side FET Driver; Manufacturer: International Rectifier; Vendor PN: IR2183SPBFCT-ND; Manu PN: IR2183STRPBF; Vendor: Digi-Key; Vertex PN: 6400005
U13 = OP296: OP296 Micropower Op Amp; Manufacturer: Analog Devices Inc; Vendor: Digi-Key; Vendor PN: OP296GSZ-ND; Manu PN: OP296GSZ; Vertex PN: 6400010

## Sheet 230C_5V_PSU_TPS40200.SchDoc: Communications
size Tabloid; CompanyName: Vertex; Organization: Vertex Downhole Ltd.; Address1: 7004 5 St SE Unit C; Address2: Calgary, AB; Address3: T2H 2G3; Address4: Canada; DocumentNumber: 550014; Revision: 4.1; SheetNumber: 6; SheetTotal: 8; Operating Temperature Range: -55°C ~ 230°C
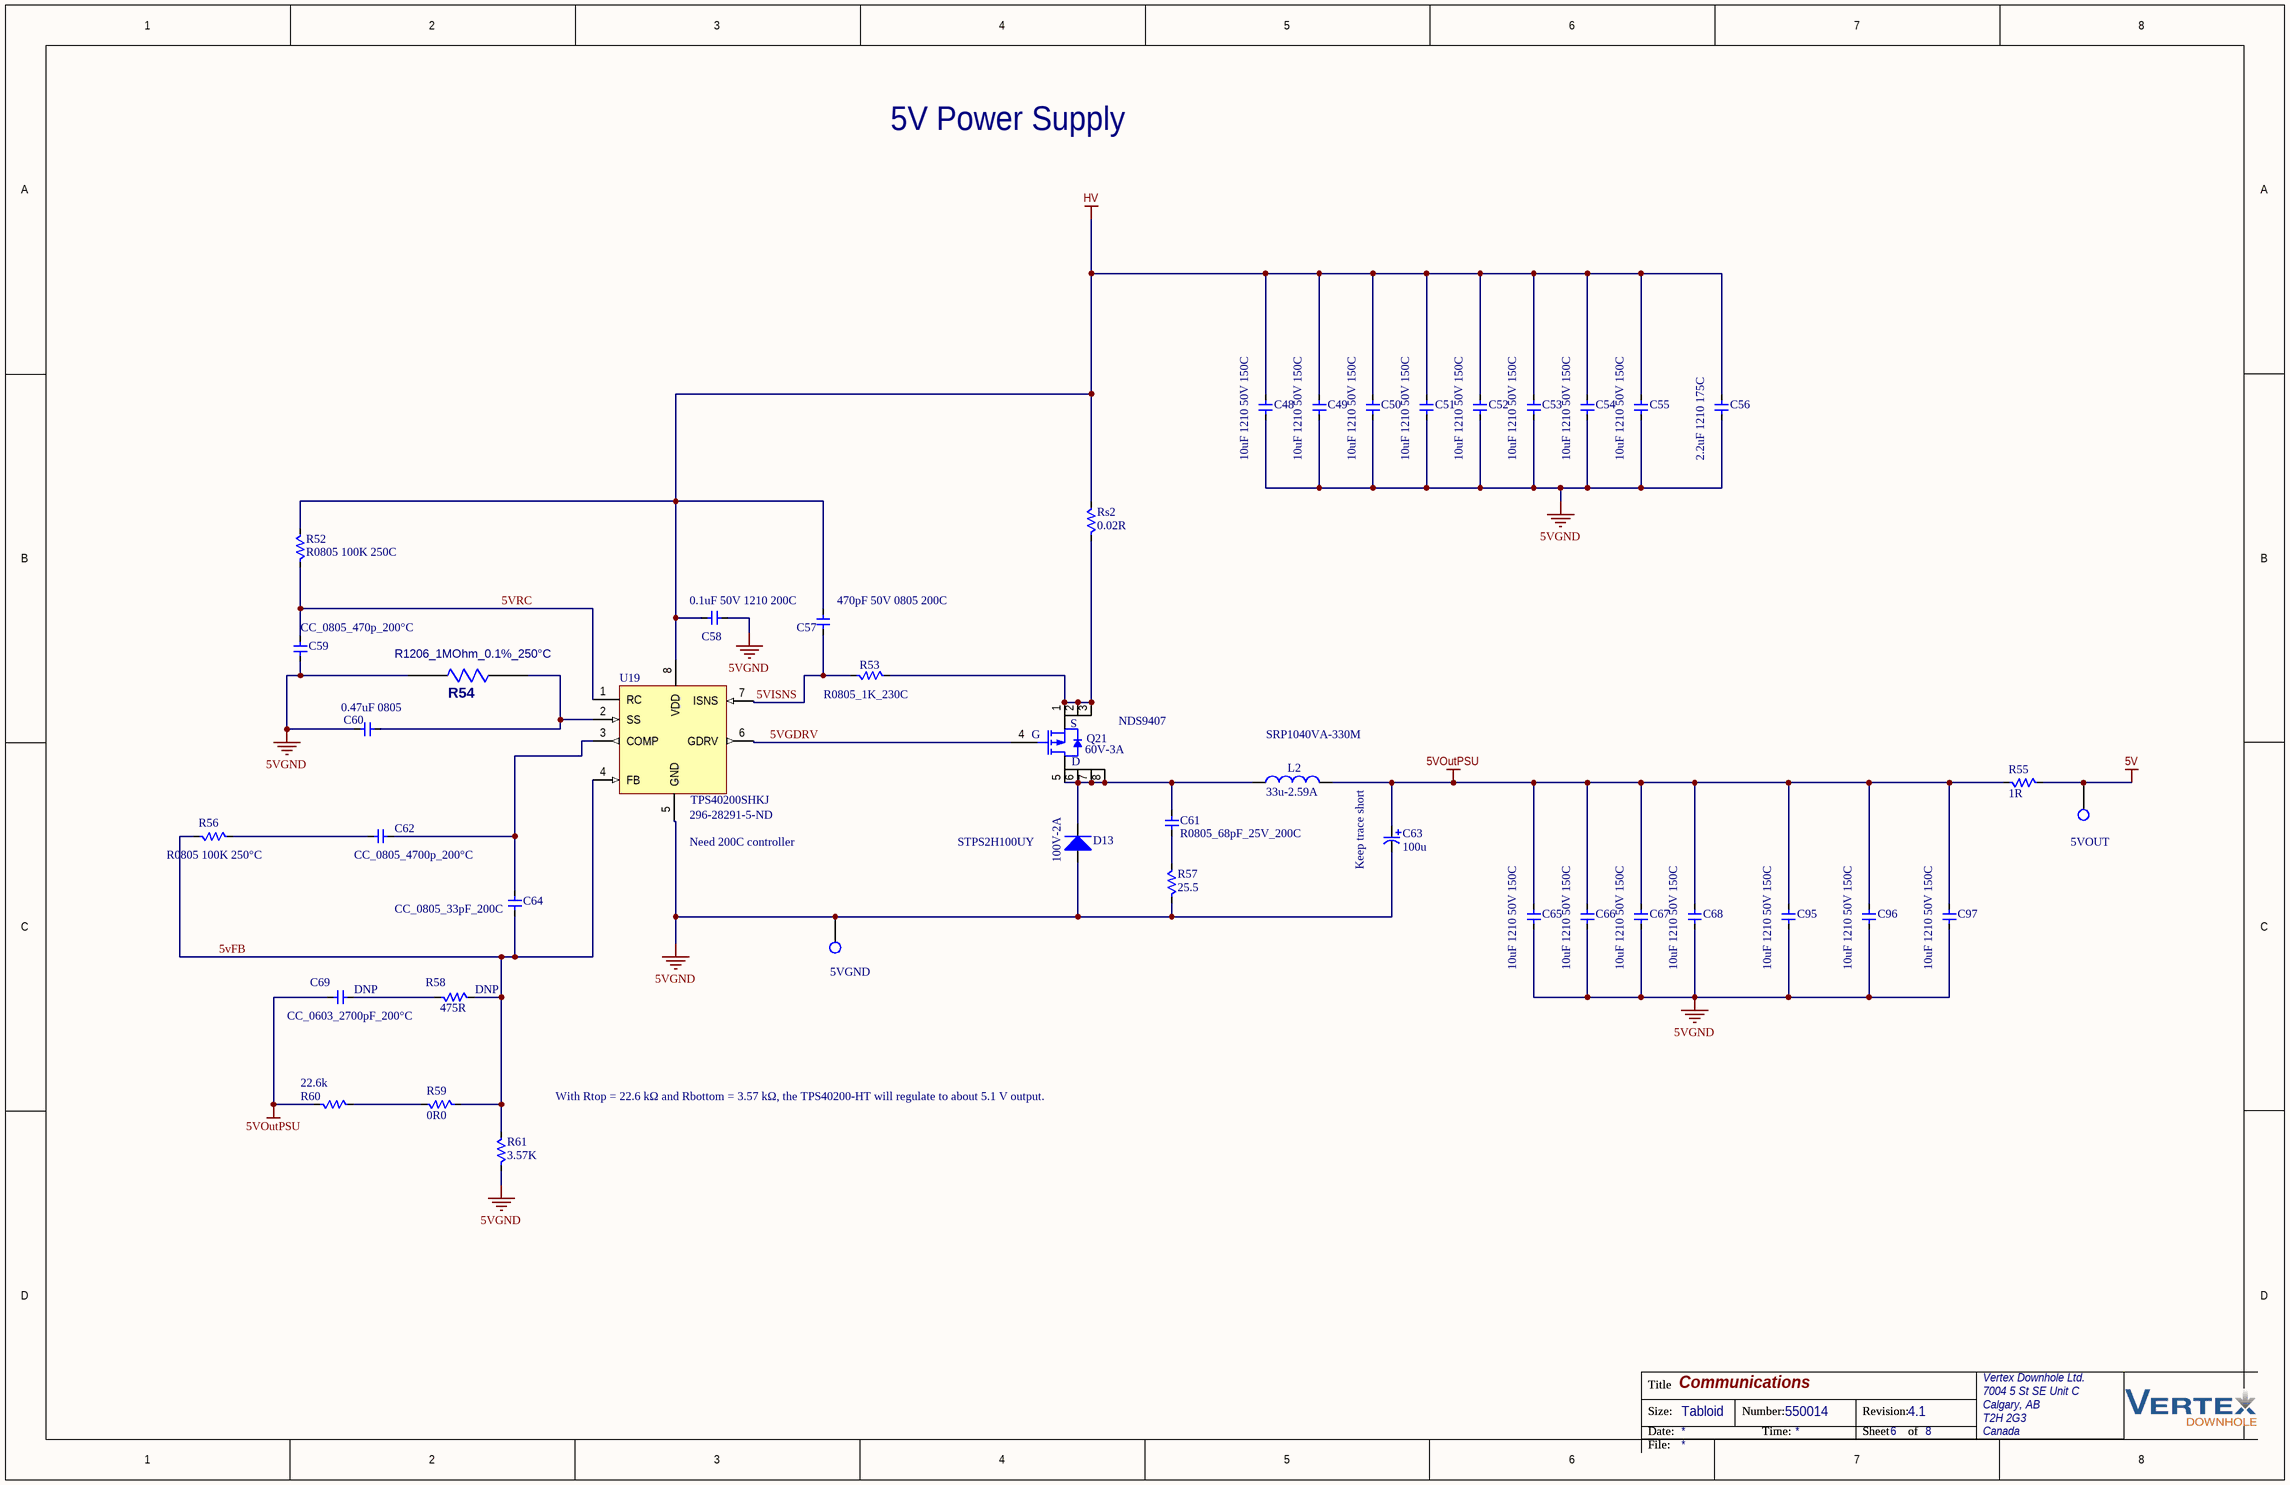
[diagram p4: 230C_5V_PSU_TPS40200.SchDoc]

### Parts
3  5VOUT  [TP-S]  (no BOM)
4  5VGND  [TP-S]  (no BOM)
C48  value 10uF 1210 50V 150C  [1210]  (hidden comment: GCM32EL8EH106KA07K)
C49  value 10uF 1210 50V 150C  [1210]  (hidden comment: GCM32EL8EH106KA07K)
C50  value 10uF 1210 50V 150C  [1210]  (hidden comment: GCM32EL8EH106KA07K)
C51  value 10uF 1210 50V 150C  [1210]  (hidden comment: GCM32EL8EH106KA07K)
C52  value 10uF 1210 50V 150C  [1210]  (hidden comment: GCM32EL8EH106KA07K)
C53  value 10uF 1210 50V 150C  [1210]  (hidden comment: GCM32EL8EH106KA07K)
C54  value 10uF 1210 50V 150C  [1210]  (hidden comment: GCM32EL8EH106KA07K)
C55  value 10uF 1210 50V 150C  [1210]  (hidden comment: GCM32EL8EH106KA07K)
C56  value 2.2uF 1210 175C  [1210]  (hidden comment: C1206H104J3GACTU)
C57  value 470pF 50V 0805 200C  [1210]  (hidden comment: C1206H104J3GACTU)
C58  value 0.1uF 50V 1210 200C  [0805]  (hidden comment: 0805D121J251KHT)
C59  value CC_0805_470p_200°C  [0805]  (hidden comment: C0805H471J1GACTU)
C60  value 0.47uF 0805  [0805]  (hidden comment: C0805C272K5HACTU)
C61  value R0805_68pF_25V_200C  [0805]  (hidden comment: C0805H680J3GACTU)
C62  value CC_0805_4700p_200°C  [0805]  (hidden comment: C0805H472J1GACT500)
C63  value 100u  [0805]  (hidden comment: 0805D121J251KHT)
C64  value CC_0805_33pF_200C  [1210]  (hidden comment: C1206H104J3GACTU)
C65  value 10uF 1210 50V 150C  [1210]  (hidden comment: GCM32EL8EH106KA07K)
C66  value 10uF 1210 50V 150C  [1210]  (hidden comment: GCM32EL8EH106KA07K)
C67  value 10uF 1210 50V 150C  [1210]  (hidden comment: GCM32EL8EH106KA07K)
C68  value 10uF 1210 50V 150C  [1210]  (hidden comment: GCM32EL8EH106KA07K)
C69  value CC_0603_2700pF_200°C  [0603]  (hidden comment: C1206H104J3GACTU)
C95  value 10uF 1210 50V 150C  [1210]  (hidden comment: GCM32EL8EH106KA07K)
C96  value 10uF 1210 50V 150C  [1210]  (hidden comment: GCM32EL8EH106KA07K)
C97  value 10uF 1210 50V 150C  [1210]  (hidden comment: GCM32EL8EH106KA07K)
D13  value 100V-2A  [SMB]  (hidden comment: STPS2H100UY)
L2  value 33u-2.59A  [IND_CB_DRA125]  (hidden comment: DRA125-470-R)
Q21  value 60V-3A  [SOIC_S9407_ONS]  (hidden comment: NDS9407)
R52  value R0805 100K 250C  [0805]  (hidden comment: PATT0805E1003BGT1)
R53  value R0805_1K_230C  [0805]  (hidden comment: ERJ-PB6B6812V)
R54  R1206_1MOhm_0.1%_250°C  [1206]
R55  value 1R  [0805]  (hidden comment: RS73F2ATTD1501B)
R56  value R0805 100K 250°C  [0805]  (hidden comment: PATT0805E1003BGT1)
R57  value 25.5  [0805]  (hidden comment: ERJ-PB6B1004V)
R58  value 475R  [0805]  (hidden comment: ERJ-PB6B6812V)
R59  value 0R0  [0805]  (hidden comment: PATT0603E49R9BGT1)
R60  value 22.6k  [0805]  (hidden comment: PATT0805E1003BGT1)
R61  value 3.57K  [0805]  (hidden comment: RNCP0805FTD1R00)
Rs2  value 0.02R  [1206]  (hidden comment: ERJ-8CWFR020V)
U19  Supplier Part Number 1: 296-28291-5-ND  [SOIC_S9407_ONS]  (hidden comment: TPS40200SHKJ)

### Nets
5V: 3.1 R55.2
5VGND: 4.1 C48.1 C49.1 C50.1 C51.1 C52.1 C53.1 C54.1 C55.1 C56.1 C58.2 C59.1 C60.1 C63.2 C65.1 C66.1 C67.1 C68.1 C95.1 C96.1 C97.1 D13.A R54.1(A) R57.1 R61.1 U19.5(GND)
5VOutPSU: C63.1 C65.2 C66.2 C67.2 C68.2 C69.1 C95.2 C96.2 C97.2 L2.2 R55.1 R60.1
HV: C48.2 C49.2 C50.2 C51.2 C52.2 C53.2 C54.2 C55.2 C56.2 C57.1 C58.1 R52.2 Rs2.2 U19.8(VDD)  [project net 3V3_VDD]
5vFB: C64.1 R56.1 R58.2 R59.1 R61.2 U19.4(FB)
5VGDRV: Q21.4(G) U19.6(GDRV)
5VISNS: C57.2 R53.1 U19.7(ISNS)
5VRC: C59.2 R52.1 U19.1(RC)
NetC60_2: C60.2 R54.2(B) U19.2(SS)
NetC61_1: C61.1 R57.2
NetC61_2: C61.2 D13.K L2.1 Q21.5(D) Q21.6(D) Q21.7(D) Q21.8(D)
NetC62_1: C62.1 R56.2
NetC62_2: C62.2 C64.2 U19.3(COMP)
NetC69_2: C69.2 R58.1
NetQ21_1: Q21.1(S) Q21.2(S) Q21.3(S) R53.2 Rs2.1
NetR59_2: R59.2 R60.2

### Notes on the sheet
- 5V Power Supply
- (near Q21) NDS9407
- (near L2) SRP1040VA-330M
- (near U19) Need 200C controller
- STPS2H100UY
- Keep trace short
- (near C69) DNP
- (near R58) DNP
- With Rtop = 22.6 kΩ and Rbottom = 3.57 kΩ, the TPS40200-HT will regulate to about 5.1 V output.
- Title
- Size:
- Date:
- Tabloid
- Number:
- Time:
- Revision:
- Sheet
- of
- File:

### Library data of the parts
3 4 = TP: as 1 on sheet 230C_3V3_PSU_TPS40200; RoHS: 0; Package: Through hole
C48 C65 = CC-1210: as C26 on sheet 230C_3V3_PSU_TPS40200; CES#: *; Voltage: 50V; Temperature: -55°C ~ 150°C; Height: 1.6mm; MfgPN: GCM32EL8EH106KA07K; Unit Price: 19.5; Notes: *; Package: CC-1210; Dimension: 3.20mm x 1.60mm; #1Mfg: *; #1MfgPN: *; Temperature Tested: *
C49-C55 C66-C68 C95-C97 = CC-1210: as C27 on sheet 230C_3V3_PSU_TPS40200; CES#: *; Voltage: 50V; Temperature: -55°C ~ 200°C; Height: 1.6mm; MfgPN: GCM32EL8EH106KA07K; Unit Price: 19.5; Notes: *; Package: CC-1210; Dimension: 3.20mm x 1.60mm; #1Mfg: *; #1MfgPN: *; Temperature Tested: *
C56 = CC-1210: as C34 on sheet 230C_3V3_PSU_TPS40200; CES#: *; Temperature: -55°C ~ 200°C; Height: 1.6mm; MfgPN: C1206H104J3GACTU; Unit Price: 19.5; Notes: *; Package: CC-1206; Dimension: 3.20mm x 1.60mm; #1Mfg: *; #1MfgPN: *; Temperature Tested: *
C57 = CC-0805-100p-100V-10%-200C-NP0: as C35 on sheet 230C_3V3_PSU_TPS40200; Temperature: -55°C ~ 200°C; Height: 1.37mm; Unit Price: 0.34; Notes: *; Package: CC-0805; Dimension: 1.60mm x 0.80mm; #1Mfg: *; #1MfgPN: *; Temperature Tested: *
C58 = CC-1210: as C36 on sheet 230C_3V3_PSU_TPS40200; CES#: *; Temperature: -55°C ~ 200°C; Height: 1.6mm; Unit Price: 19.5; Notes: *; Package: CC-1206; Dimension: 3.20mm x 1.60mm; #1Mfg: *; #1MfgPN: *; Temperature Tested: *
C59 = CC-0805-470p-100V-10%-150C-NP0: as C37 on sheet 230C_3V3_PSU_TPS40200; CES#: *; Voltage: 100V; Temperature: -55°C ~ 200°C; Height: 1.25mm; MfgPN: C0805H471J1GACTU; Unit Price: 0.47; Notes: *; Package: CC-0805; Dimension: 2.00mm x 1.25mm; #1Mfg: *; #1MfgPN: *; Temperature Tested: *
C60 = CC-0805-47n-25V-5%-125C-NP0: as C38 on sheet 230C_3V3_PSU_TPS40200; CES#: *; Voltage: 25V; Temperature: -55°C ~ 125°C; Height: 1.25mm; Unit Price: 0.95; Notes: *; Package: CC-0805; Dimension: 2.00mm x 1.25mm; #1Mfg: *; #1MfgPN: *; Temperature Tested: *
C61 = CC-0805-2200p-100V-5%-200C-NP0: as C39 on sheet 230C_3V3_PSU_TPS40200; Voltage: 100V; Temperature: -55°C ~ 200°C; Height: 0.9mm; MfgPN: C0805H680J3GACTU; Unit Price: 2.65; Notes: *; Package: CC-0805; Dimension: 2.00mm x 1.25mm; #1Mfg: *; #1MfgPN: *; Temperature Tested: *; Supplier 1: Digi-Key
C62 = CC-0805-2200p-100V-5%-200C-NP0: as C40 on sheet 230C_3V3_PSU_TPS40200; Voltage: 100V; Temperature: -55°C ~ 200°C; Height: 0.9mm; MfgPN: C0805H472J1GACT500; Unit Price: 2.65; Notes: *; Package: CC-0805; Dimension: 2.00mm x 1.25mm; #1Mfg: *; #1MfgPN: *; Temperature Tested: *; Supplier 1: Digi-Key
C63 = CT-2917-100u-16V-10%-150C: as C41 on sheet 230C_3V3_PSU_TPS40200; CES#: *; Voltage: 16V; Tolerance: ±10%; Temperature: -55°C ~ 150°C; Height: 4.1mm; Unit Price: 6.63; Notes: *; Package: CT-2917; Dimension: 7.30mm x 4.30mm; #1Mfg: *; #1MfgPN: *; Temperature Tested: *
C64 = CC-0805-120p-100V-5%-200C-NP0: as C42 on sheet 230C_3V3_PSU_TPS40200; Voltage: 250V; Temperature: -55°C ~ 200°C; Height: 1.37mm; VendorPN: 0805D121J251KHT; Unit Price: 0.25; Notes: *; Package: CC-0805; Dimension: 2.03mm x 1.27mm; #1Mfg: *; #1MfgPN: *; Temperature Tested: *
C69 = CC-0805-2700p-50V-10%-150C: as C47 on sheet 230C_3V3_PSU_TPS40200; CES#: *; Voltage: 50V; Temperature: -55°C ~ 200°C; Height: 1.25mm; Unit Price: 0.84; Notes: *; Package: CC-0805; Dimension: 2.00mm x 1.25mm; #1Mfg: *; #1MfgPN: *; Temperature Tested: *
D13 = DS-SMB-100V-2A: as D12 on sheet 230C_3V3_PSU_TPS40200; CES#: *; Temperature: -40°C ~ 175°C; Voltage: 100V; Height: 1.9 mm; MfgPN: STPS2H100UY; Unit Price: 0.81; Notes: *; Current: 2A; Package: SMB; Dimension: 3.5 X 2.8 X 1.9 mm; #1Mfg: *; #1MfgPN: *; Temperature Tested: *
L2 = LL-12.5X12.5-47u-2.59A: as L1 on sheet 230C_3V3_PSU_TPS40200; CES#: *; Temperature: -40°C ~ 165°C; Height: 6 mm; MfgPN: DRA125-470-R; Unit Price: 4.36; Current: 2.59A; Package: LL-12.5X12.5; Dimension: 12.50mm x 12.50mm; #2Mfg: *; #2MfgPN: *; Temperature Tested: *
Q21 = QF-SOIC8-PCH-60V-3A: as Q20 on sheet 230C_3V3_PSU_TPS40200; Temperature: -55°C ~ 175°C (TJ); Voltage: 60V; Height: 1.7 mm; MfgPN: NDS9407; VendorPN: NDS9407; Unit price: 1.55; Package: SOIC8; Dimension: 6.2 X 5.0 X 1.7 mm; Current: 3A; #2Mfg: *; #2MfgPN: *; Temperature Tested: *
R52 R56 R60 = RS-0805-9.1K-0.1%-1/4W-155C: as R42 on sheet 230C_3V3_PSU_TPS40200; Tolerance: ±0.1%; Temperature: -55°C ~ 250°C; Height: 0.46 mm; MfgPN: PATT0805E1003BGT1; Unit Price: 0.55; Notes: *; Package: RS-0805; Dimension: 1.60mm x 0.80mm; #2Mfg: *; #2MfgPN: *; Temperature Tested: *
R53 = RS-0805-1K-0.1%-1/8W-155C: as R43 on sheet 230C_3V3_PSU_TPS40200; CES#: *; Temperature: -55°C ~ 230°C; Height: 0.7 mm; Notes: *; Package: RS-0805; Dimension: 2.00mm x 1.25mm; #2Mfg: *; #2MfgPN: *; Temperature Tested: *
R54 = RC_1206: as R44 on sheet 230C_3V3_PSU_TPS40200
R55 = RS-0805-1R-1%-0.25W-155C: as R45 on sheet 230C_3V3_PSU_TPS40200; CES#: *; Tolerance: ±1%; Temperature: -55°C ~ 155°C; Height: 0.7 mm; VendorPN: RNCP0805FTD1R00; Unit Price: 0.15; Notes: *; Package: RS-0805; Dimension: 2.00mm x 1.25mm; #2Mfg: *; #2MfgPN: *; Temperature Tested: *
R57 = RS-0805-10.2K-0.1%-0.25W-155C: as R47 on sheet 230C_3V3_PSU_TPS40200; Tolerance: ±1%; Temperature: -55°C ~ 155°C; Height: 0.7 mm; Unit Price: 0.55; Notes: *; Package: RS-0805; Dimension: 2.00mm x 1.25mm; #2Mfg: *; #2MfgPN: *; Temperature Tested: *
R58 = RS-0805-475R-0.1%-0.25W-155C: as R48 on sheet 230C_3V3_PSU_TPS40200; Tolerance: ±0.1%; Temperature: -55°C ~ 155°C; Height: 0.7 mm; Unit Price: 0.55; Notes: *; Package: RS-0805; Dimension: 2.00mm x 1.25mm; #2Mfg: *; #2MfgPN: *; Temperature Tested: *
R59 = RS-0805-1.5K-0.1%-1/4W-155C: as R49 on sheet 230C_3V3_PSU_TPS40200; CES#: *; Tolerance: ±0.1%; Temperature: -55°C ~ 255°C; Height: 0.46 mm; MfgPN: PATT0603E49R9BGT1; Notes: *; Package: RS-0805; Dimension: 2.00mm x 1.25mm; #2Mfg: *; #2MfgPN: *; Temperature Tested: *
R61 = RS-0805-49.9R-0.25%-0.25W-155C: as R51 on sheet 230C_3V3_PSU_TPS40200; Tolerance: ±0.1%; Temperature: -55°C ~ 155°C; Height: 0.5 mm; Unit Price: 0.113; Notes: *; Package: RS-0603; Dimension: 1.60mm x 0.80mm; #2Mfg: *; #2MfgPN: *; Temperature Tested: *
Rs2 = RS-1206-0.02R-1%-1W-155C: as Rs1 on sheet 230C_3V3_PSU_TPS40200; CES#: *; Tolerance: ±1%; Temperature: -55°C ~ 155°C; Height: 0.6; MfgPN: ERJ-8CWFR020V; Unit Price: 1.04; Notes: *; Power: 1W; Package: RS-1206; Dimension: 1.60mm x 3.20mm; #2Mfg: *; #2MfgPN: *; Temperature Tested: *
U19 = UP-SREG-CFP8-Buck-ADJ-TPS40200: as U18 on sheet 230C_3V3_PSU_TPS40200; Topology: Buck; Temperature: -55°C ~ 210°C (TA); Height: 2.0 mm; MfgPN: TPS40200SHKJ; Unit Price: 140.54; Notes: *; Package: CFP-8; Dimension: 24.7 X 7.3 X 2.0; #2Mfg: *; #2MfgPN: *; Temperature Tested: *; Value: TPS40200SHKJ; Supplier 1: Digi-Key